# Altium schematic sheet LEDs.SchDoc
size A4; SheetNumber: 5; SheetTotal: 7
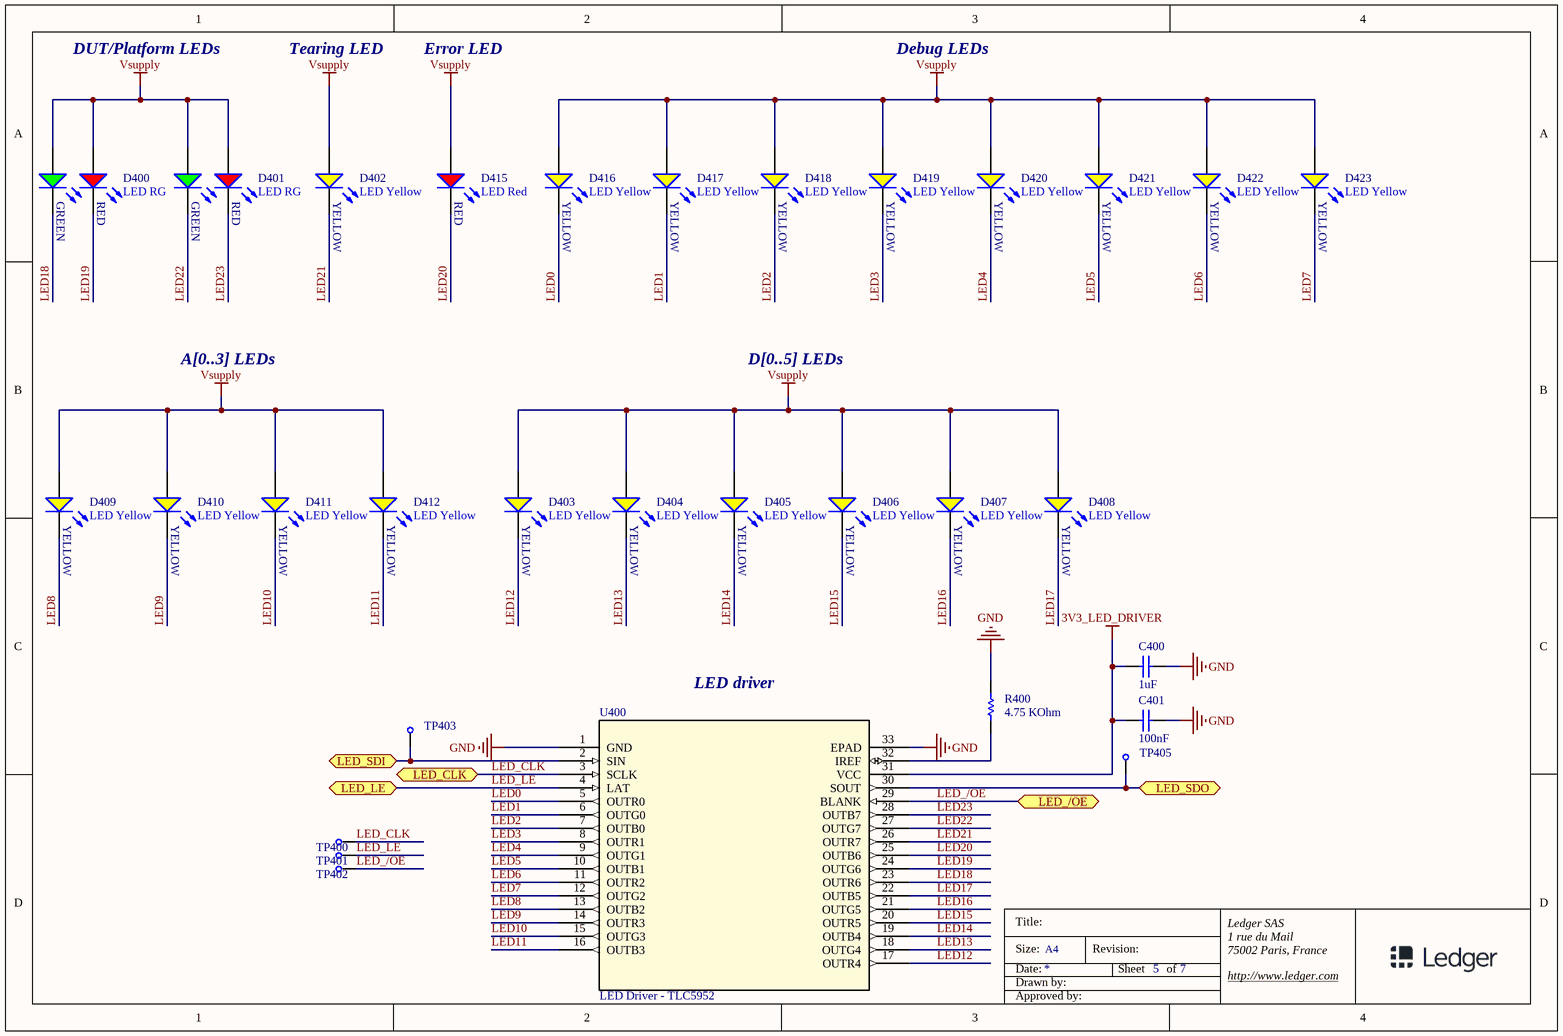
[diagram p0: LEDs.SchDoc]

## Parts
C400  1uF  [CAP0603]
C401  100nF  [CAP0603]
D400  LED RG  [PLCC-4_3528]
D401  LED RG  [PLCC-4_3528]
D402  LED Yellow  [KINGBRIGHT_AA3528]
D403  LED Yellow  [KINGBRIGHT_AA3528]
D404  LED Yellow  [KINGBRIGHT_AA3528]
D405  LED Yellow  [KINGBRIGHT_AA3528]
D406  LED Yellow  [KINGBRIGHT_AA3528]
D407  LED Yellow  [KINGBRIGHT_AA3528]
D408  LED Yellow  [KINGBRIGHT_AA3528]
D409  LED Yellow  [KINGBRIGHT_AA3528]
D410  LED Yellow  [KINGBRIGHT_AA3528]
D411  LED Yellow  [KINGBRIGHT_AA3528]
D412  LED Yellow  [KINGBRIGHT_AA3528]
D415  LED Red  [KINGBRIGHT_AA3528]
D416  LED Yellow  [KINGBRIGHT_AA3528]
D417  LED Yellow  [KINGBRIGHT_AA3528]
D418  LED Yellow  [KINGBRIGHT_AA3528]
D419  LED Yellow  [KINGBRIGHT_AA3528]
D420  LED Yellow  [KINGBRIGHT_AA3528]
D421  LED Yellow  [KINGBRIGHT_AA3528]
D422  LED Yellow  [KINGBRIGHT_AA3528]
D423  LED Yellow  [KINGBRIGHT_AA3528]
R400  4.75 KOhm  [RES0603]
TP400  (no value)  [TP_001]  (no BOM)
TP401  (no value)  [TP_001]  (no BOM)
TP402  (no value)  [TP_001]  (no BOM)
TP403  (no value)  [TP_001]  (no BOM)
TP405  (no value)  [TP_001]  (no BOM)
U400  LED Driver - TLC5952  [HTSSOP32]

## Ports
LED_/OE, LED_CLK, LED_LE, LED_SDI, LED_SDO

## Nets
3V3_LED_DRIVER: C400.1 C401.1 U400.31(VCC)
GND: C400.2 C401.2 R400.2 U400.1(GND) U400.33(EPAD)
Vsupply: D400.1(AR) D400.2(AG) D401.1(AR) D401.2(AG) D402.2(A) D403.2(A) D404.2(A) D405.2(A) D406.2(A) D407.2(A) D408.2(A) D409.2(A) D410.2(A) D411.2(A) D412.2(A) D415.2(A) D416.2(A) D417.2(A) D418.2(A) D419.2(A) D420.2(A) D421.2(A) D422.2(A) D423.2(A)
LED0: D416.1(K) U400.5(OUTR0)
LED1: D417.1(K) U400.6(OUTG0)
LED2: D418.1(K) U400.7(OUTB0)
LED3: D419.1(K) U400.8(OUTR1)
LED4: D420.1(K) U400.9(OUTG1)
LED5: D421.1(K) U400.10(OUTB1)
LED6: D422.1(K) U400.11(OUTR2)
LED7: D423.1(K) U400.12(OUTG2)
LED8: D409.1(K) U400.13(OUTB2)
LED9: D410.1(K) U400.14(OUTR3)
LED10: D411.1(K) U400.15(OUTG3)
LED11: D412.1(K) U400.16(OUTB3)
LED12: D403.1(K) U400.17(OUTR4)
LED13: D404.1(K) U400.18(OUTG4)
LED14: D405.1(K) U400.19(OUTB4)
LED15: D406.1(K) U400.20(OUTR5)
LED16: D407.1(K) U400.21(OUTG5)
LED17: D408.1(K) U400.22(OUTB5)
LED18: D400.4(KG) U400.23(OUTR6)
LED19: D400.3(KR) U400.24(OUTG6)
LED20: D415.1(K) U400.25(OUTB6)
LED21: D402.1(K) U400.26(OUTR7)
LED22: D401.4(KG) U400.27(OUTG7)
LED23: D401.3(KR) U400.28(OUTB7)
LED_/OE: TP402.1 U400.29(BLANK) ; port LED_/OE
LED_CLK: TP400.1 U400.3(SCLK) ; port LED_CLK
LED_LE: TP401.1 U400.4(LAT) ; port LED_LE
LED_SDI: TP403.1 U400.2(SIN) ; port LED_SDI
LED_SDO: TP405.1 U400.30(SOUT) ; port LED_SDO
NetR400_1: R400.1 U400.32(IREF)

## Notes on the sheet
- DUT/Platform LEDs
- Tearing LED
- Error LED
- Debug LEDs
- A[0..3] LEDs
- D[0..5] LEDs
- LED driver
- Title:
- Size:
- Date:
- Drawn by:
- A4
- Revision:
- Sheet
- of
- Ledger SAS
- 1 rue du Mail
- 75002 Paris, France
- http://www.ledger.com
- Approved by:
- (in symbol Opto - DEL - Red 625nm - 2mA -120 mcd) RED
- (in symbol Opto - DEL - RG 630/572nm 250/60 mcd - 20mA) GREEN; RED
- (in symbol Opto - DEL - Yellow 590nm - 2mA -30 mcd) YELLOW

## Library data of the parts
C400 = Capacitor 0603 -     1uF - 16V - X7R - 10%: Capacitor 0603 - 1uF - 16V - X7R - 10%; Manufacturer: Kemet; Manufacturer PN: C0603C105K4RACTU; Manufacturer1: Murata; Manufacturer1 PN: GCM188R71C105K; Manufacturer2 PN: 885012206052; PkgCode: 0603; Value: 1uF; Type: X7R; Power: 16V; Tolerance: 10%; Manufacturer2: Wurth
C401 = Capacitor 0603 - 100nF - 16V - X7R - 10%: Manufacturer2 PN: MCCA000159; Manufacturer1: Yageo; Manufacturer1 PN: CC0603KRX7R7BB104; Manufacturer: Wurth; Manufacturer PN: 885012206046; PkgCode: 0603; Manufacturer2: Multicomp; Value: 100nF; Power: 16V; Tolerance: 10%; Type: X7R
D400 D401 = Opto - DEL - RG 630/572nm 250/60 mcd - 20mA: Manufacturer: Wurth; Manufacturer PN: 150141RV73100
D402-D412 D416-D423 = Opto - DEL - Yellow 590nm - 2mA -30 mcd: Manufacturer: Kingbright; Manufacturer PN: AA3528LSYCKT/J3
D415 = Opto - DEL - Red 625nm - 2mA -120 mcd: Manufacturer: Kingbright; Manufacturer PN: AA3528LSECKT/J3
R400 = Resistor 0603 - 4.75KOhm - 1/10W - 1%: Manufacturer: Vishay; Manufacturer PN: CRCW06034K75FKEA; PkgCode: 0603; Value: 4.75 KOhm; Tolerance: 1%; Power: 1/10W
TP400-TP403 TP405 = Misc - Test point CMS
U400 = Power - LED Driver - 24 LEDs - TLC5952 -  HTSSOP32: Manufacturer PN: TLC5952DAP; Manufacturer: Texas Instruments; PkgRef: HTSSOP32